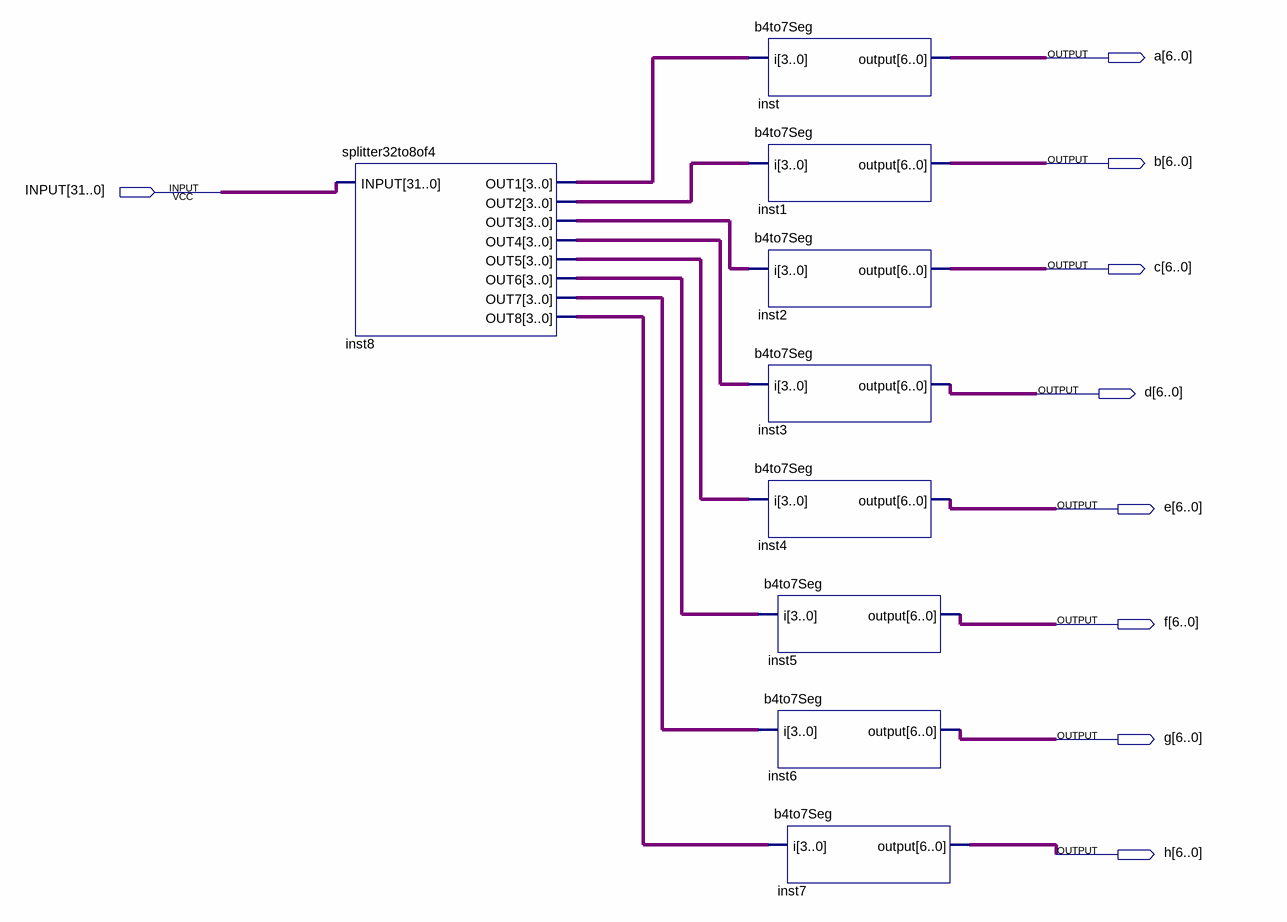
[diagram p0: schematic sheet]
// Quartus schematic 7segout.bdf as structural Verilog: 9 symbols, 9 pins
module \7segout  (
  input  [31:0] INPUT,
  output [6:0] a,
  output [6:0] b,
  output [6:0] c,
  output [6:0] d,
  output [6:0] e,
  output [6:0] f,
  output [6:0] g,
  output [6:0] h
);

  wire [3:0] inst8_out1, inst8_out2, inst8_out3, inst8_out4, inst8_out5, inst8_out6, inst8_out7, inst8_out8;

  splitter32to8of4 inst8 (
    .INPUT(INPUT), .OUT1(inst8_out1), .OUT2(inst8_out2), .OUT3(inst8_out3), .OUT4(inst8_out4),
    .OUT5(inst8_out5), .OUT6(inst8_out6), .OUT7(inst8_out7), .OUT8(inst8_out8));
  b4to7Seg inst (.i(inst8_out1), .\output (a));
  b4to7Seg inst1 (.i(inst8_out2), .\output (b));
  b4to7Seg inst2 (.i(inst8_out3), .\output (c));
  b4to7Seg inst3 (.i(inst8_out4), .\output (d));
  b4to7Seg inst4 (.i(inst8_out5), .\output (e));
  b4to7Seg inst5 (.i(inst8_out6), .\output (f));
  b4to7Seg inst6 (.i(inst8_out7), .\output (g));
  b4to7Seg inst7 (.i(inst8_out8), .\output (h));
endmodule
